# EAGLE design StinsonFuelGauge (EAGLE 4.16)
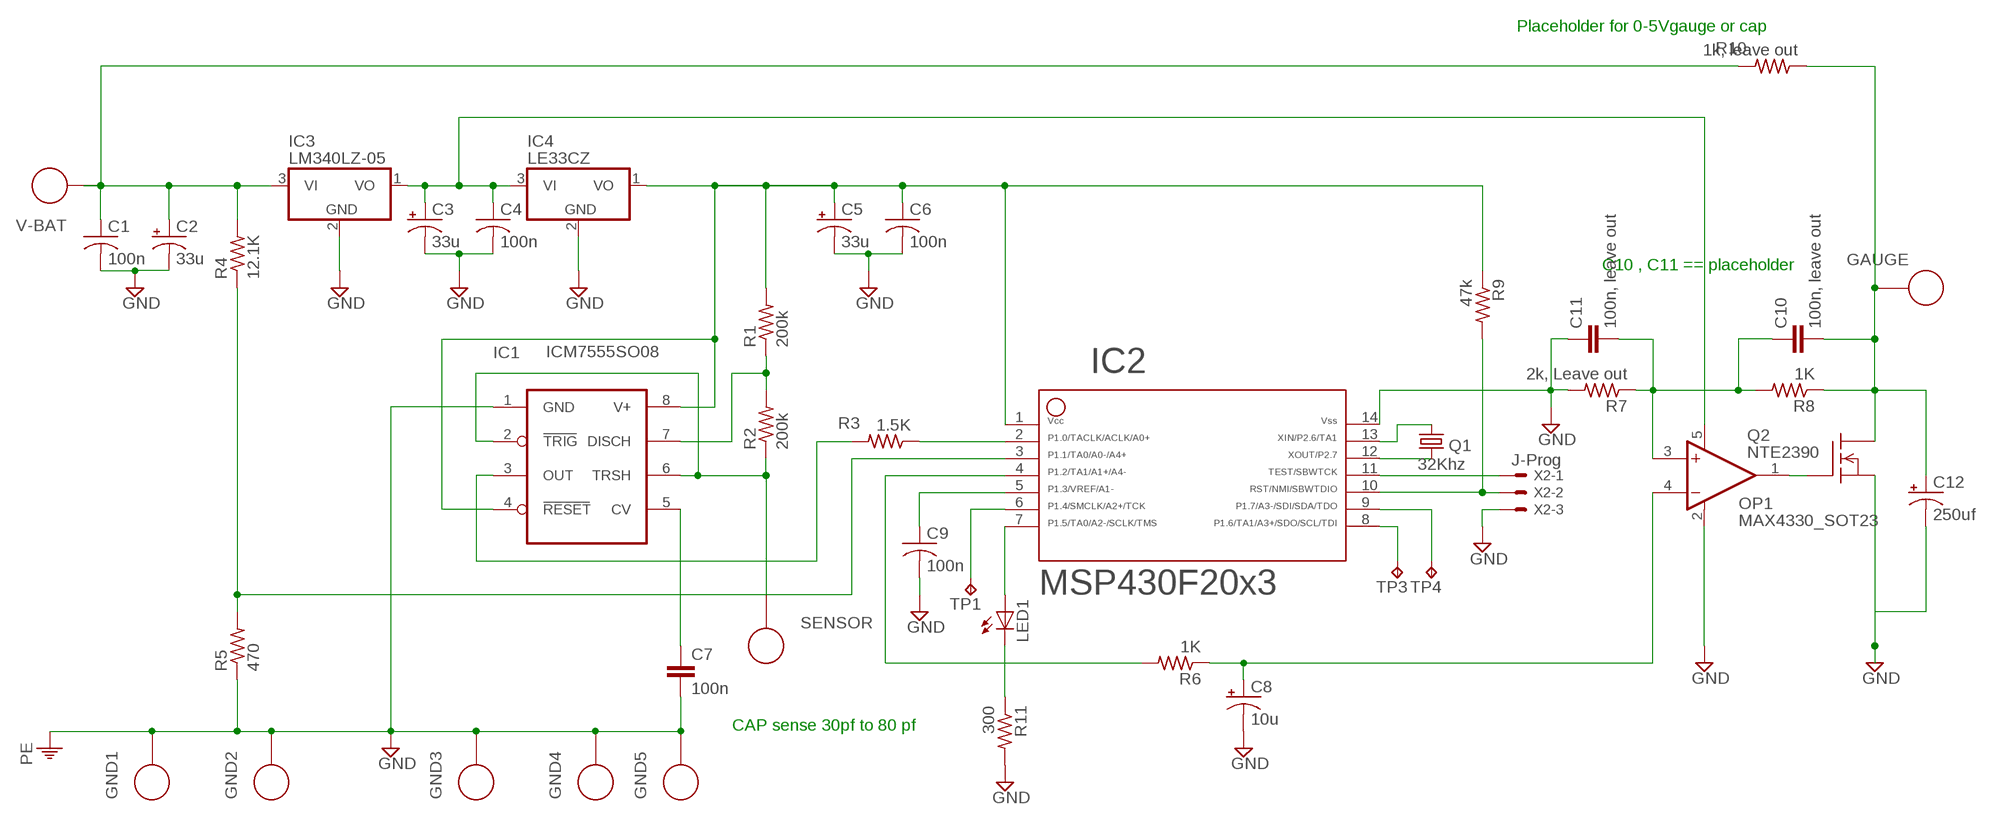
[diagram p0: schematic, sheet 1]

## Parts
C1  100n  C-USC0805  [C0805]
C2  33u  CPOL-USSMCD  [SMC_D]
C3  33u  CPOL-USSMCD  [SMC_D]
C4  100n  C-USC0805  [C0805]
C5  33u  CPOL-USSMCD  [SMC_D]
C6  100n  C-USC0805  [C0805]
C7  100n  C-EUC0805  [C0805]
C8  10u  CPOL-USSMCE  [SMC_E]
C9  100n  C-USC0805  [C0805]
C10  100n, leave out  C-EUC0805  [C0805]
C11  100n, leave out  C-EUC0805  [C0805]
C12  250uf  CPOL-USSMCE  [SMC_E]
GAUGE  TP_1TPAD_300  [PAD_1]
GND1  GND_PADTP_400  [PAD_2]
GND2  GND_PADTP_400  [PAD_2]
GND3  GND_PADTP_400  [PAD_2]
GND4  GND_PADTP_400  [PAD_2]
GND5  GND_PADTP_400  [PAD_2]
IC1  ICM7555SO08  [SO08]
IC2  F20X3---PW14  [PW14]
IC3  LM340LZ-05  [TO92]
IC4  LE33CZ  [TO92-]
LED1  LEDCHIP-LED0603  [CHIP-LED0603]
OP1  MAX4330_SOT23  [SOT23-5L]
Q1  32Khz  CRYSTALTC26H  [TC26H]
Q2  NTE2390  [TO220]
R1  200k  R-US_R0805  [R0805]
R2  200k  R-US_R0805  [R0805]
R3  1.5K  R-US_R0805  [R0805]
R4  12.1K  R-US_R0805  [R0805]
R5  470  R-US_R0805  [R0805]
R6  1K  R-US_R0805  [R0805]
R7  2k, Leave out  R-US_R0805  [R0805]
R8  1K  R-US_R0805  [R0805]
R9  47k  R-US_R0805  [R0805]
R10  1k, leave out  R-US_R0805  [R0805]
R11  300  R-US_R0805  [R0805]
SENSOR  TP_1TPAD_300  [PAD_1]
TP1  TPPAD1-13  [P1-13]
TP3  TPPAD1-13  [P1-13]
TP4  TPPAD1-13  [P1-13]
V-BAT  TP_1TPAD_300  [PAD_1]
X2  J-Prog  22-23-2031  [22-23-2031]

## Nets
C_SEN: IC1.2(TRIG) IC1.6(TRSH) R2.1 SENSOR.P$1
GND: C1.2 C2.- C3.- C4.2 C5.- C6.2 C7.2 C8.- C9.2 C11.1 C12.- GND1.P$1 GND2.P$1 GND3.P$1 GND4.P$1 GND5.P$1 IC1.1(GND) IC2.14 IC3.2(GND) IC4.2(GND) OP1.2(V-) Q2.3(S) R5.1 R7.2 R11.2 X2.3 ; supply symbol labelled PE
N$1: IC2.6 TP1.1(TP)
N$2: IC2.12 Q1.2
N$3: IC2.13 Q1.1
N$4: IC2.7 LED1.A
N$5: OP1.1(OUT) Q2.1(G)
N$7: IC1.7(DISCH) R1.1 R2.2
N$8: IC2.8 TP3.1(TP)
N$9: IC1.3(OUT) R3.2
N$10: C7.1 IC1.5(CV)
N$11: IC2.2 R3.1
N$12: IC2.9 TP4.1(TP)
N$13: IC2.3 R4.1 R5.2
N$14: C9.1 IC2.5
N$15: C8.+ OP1.4(-IN) R6.1
N$16: IC2.11 X2.1
N$17: C10.1 C11.2 OP1.3(+IN) R7.1 R8.2
N$18: C10.2 C12.+ GAUGE.P$1 Q2.2(D) R8.1 R10.1
N$19: LED1.C R11.1
N$20: IC2.10 R9.2 X2.2
PW_OUT: IC2.4 R6.2
V3_3V: C5.+ C6.1 IC1.4(RESET) IC1.8(V+) IC2.1 IC4.1(VO) R1.2 R9.1
V-5V: C3.+ C4.1 IC3.1(VO) IC4.3(VI) OP1.5(V+)
V-BAT: C1.1 C2.+ IC3.3(VI) R4.2 R10.2 V-BAT.P$1

## Notes on the sheet
- Placeholder for 0-5Vgauge or cap
- C10 , C11 == placeholder
- CAP sense 30pf to 80 pf

## Library data of the parts
C1 C4 C6 C9 = rcl:C-US: CAPACITOR, American symbol
C2 C3 C5 C8 C12 = rcl:CPOL-US: POLARIZED CAPACITOR, American symbol
C7 C10 C11 = rcl:C-EU: CAPACITOR, European symbol
GAUGE SENSOR V-BAT = ZStofer:TP_1
GND1-GND5 = ZStofer:GND_PAD
IC1 = Stofer:ICM7555: TIMER
IC2 = TI_MSP430_v12:F20X3---PW14: ***MSP430F20x3***PW14
IC3 = ZStofer:LM340?-*: Positive VOLTAGE REGULATOR Source: http://cache.national.com/ds/LM/LM340.pdf
IC4 = ZStofer:LE33CZ
LED1 = led:LED: LED OSRAM: - CHIPLED LG R971, LG N971, LY N971, LG Q971, LY Q971, LO R971, LY R971 LH N974, LH R974 LS Q976, LO Q976, LY Q976 LO Q996 - Hyper CHIPLED LW Q18S LB Q993, LB Q99A, LB R99A - SideLED LS A670, LO A670, LY A670, LG A670, LP A670 LB A673, LV A673, LT A673, LW A673 LH A674 LY A675 LS A676, LA A676, LO A676, LY A676, LW A676 LS A679, LY A679, LG A679 - Hyper Micro SIDELED® LS Y876, LA Y876, LO Y876, LY Y876 LT Y87S - SmartLED LW L88C, LW L88S LB L89C, LB L89S, LG L890 LS L89K, LO L89K, LY L89K LS L896, LA L896, LO L896, LY L896 - TOPLED LS T670, LO T670, LY T670, LG T670, LP T670 LSG T670, LSP T670, LSY T670, LOP T670, LYG T670 LG T671, LOG T671, LSG T671 LB T673, LV T673, LT T673, LW T673 LH T674 LS T676, LA T676, LO T676, LY T676, LB T676, LH T676, LSB T676, LW T676 LB T67C, LV T67C, LT T67C, LS T67K, LO T67K, LY T67K, LW E67C LS E67B, LA E67B, LO E67B, LY E67B, LB E67C, LV E67C, LT E67C LW T67C LS T679, LY T679, LG T679 LS T770, LO T770, LY T770, LG T770, LP T770 LB T773, LV T773, LT T773, LW T773 LH T774 LS E675, LA E675, LY E675, LS T675 LS T776, LA T776, LO T776, LY T776, LB T776 LHGB T686 LT T68C, LB T68C - Hyper Mini TOPLED® LB M676 - Mini TOPLED Santana® LG M470 LS M47K, LO M47K, LY M47K Source: http://www.osram.convergy.de - LUMILED® LXK2-PW12-R00, LXK2-PW12-S00, LXK2-PW14-U00, LXK2-PW14-V00 LXK2-PM12-R00, LXK2-PM12-S00, LXK2-PM14-U00 LXK2-PE12-Q00, LXK2-PE12-R00, LXK2-PE12-S00, LXK2-PE14-T00, LXK2-PE14-U00 LXK2-PB12-K00, LXK2-PB12-L00, LXK2-PB12-M00, LXK2-PB14-N00, LXK2-PB14-P00, LXK2-PB14-Q00 LXK2-PR12-L00, LXK2-PR12-M00, LXK2-PR14-Q00, LXK2-PR14-R00 LXK2-PD12-Q00, LXK2-PD12-R00, LXK2-PD12-S00 LXK2-PH12-R00, LXK2-PH12-S00 LXK2-PL12-P00, LXK2-PL12-Q00, LXK2-PL12-R00 Source: www.luxeon.com
OP1 = maxim-9:MAX4330
Q1 = crystal:CRYSTAL: CRYSTAL
Q2 = transistor-fet:NTE2390: N-Channel Enhancement MOSFET 60V; 12A
R1-R11 = rcl:R-US_: RESISTOR, American symbol
TP1 TP3 TP4 = ZStofer:TP
X2 = con-molex:22-23-2031: .100" (2.54mm) Center Header - 3 Pin

## Board
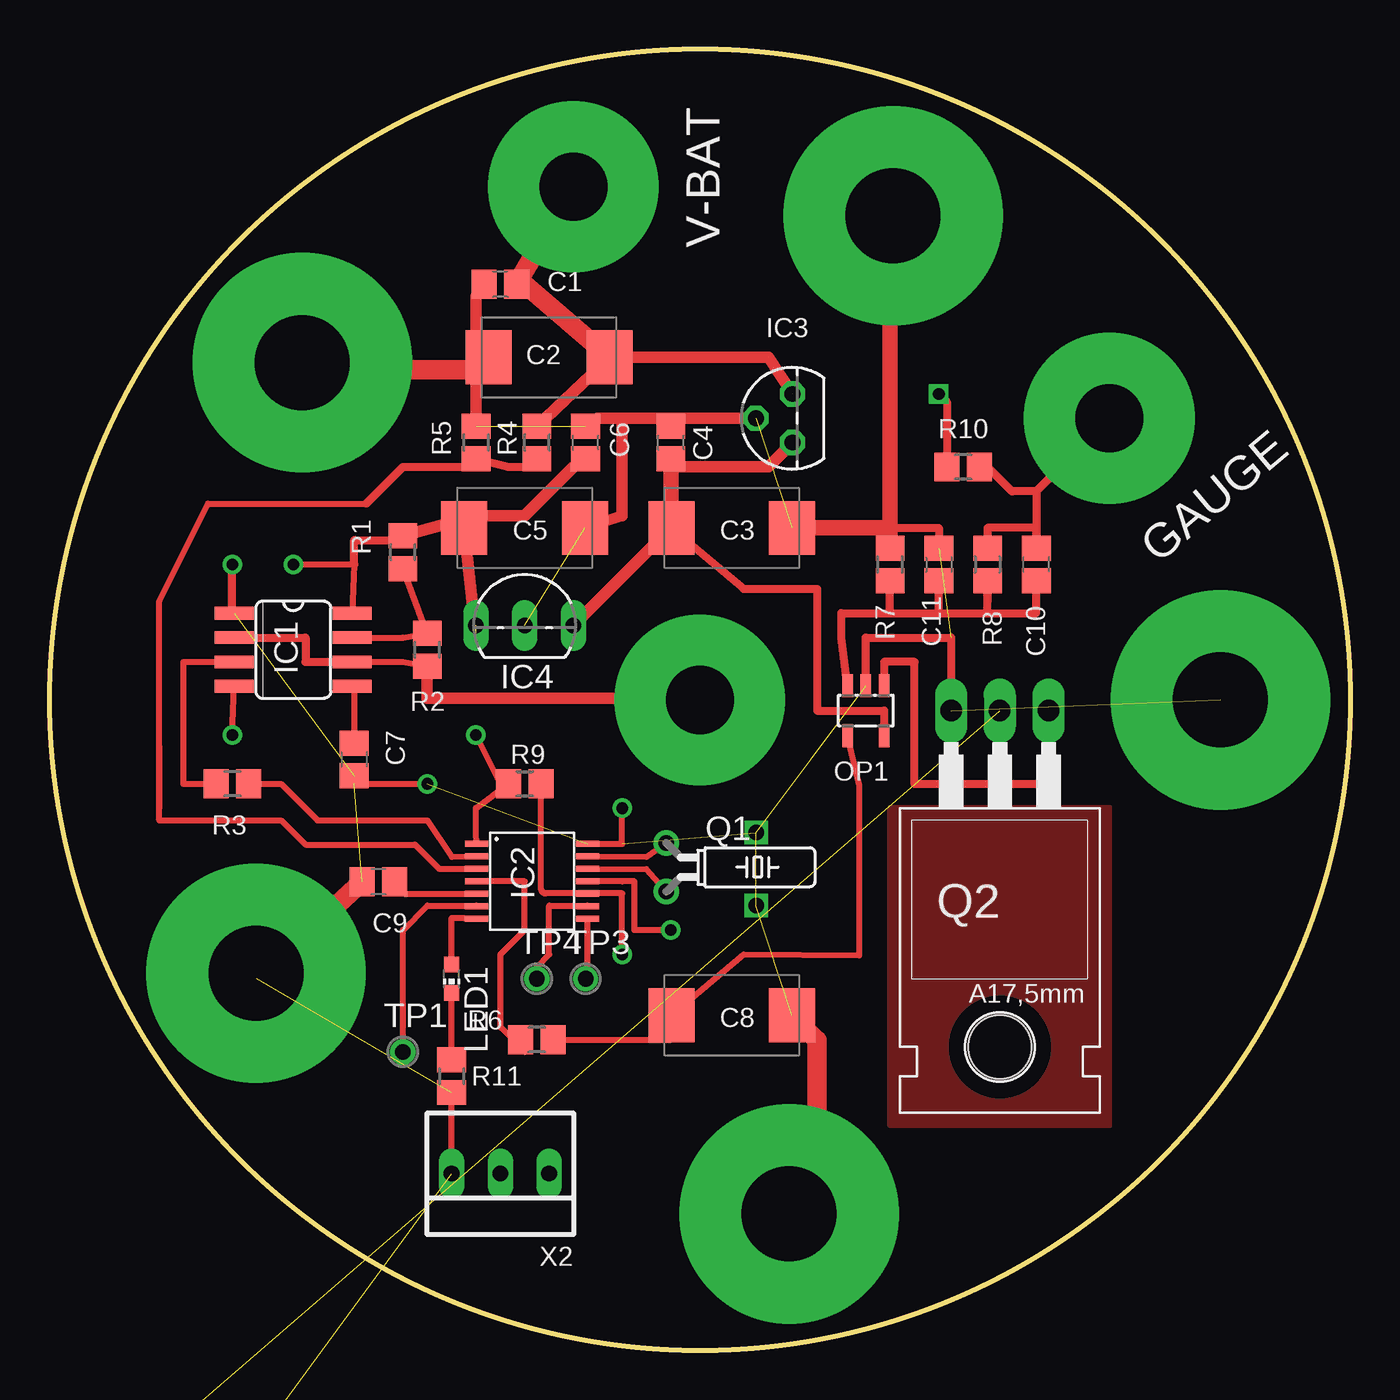
[diagram p1: board, top side]
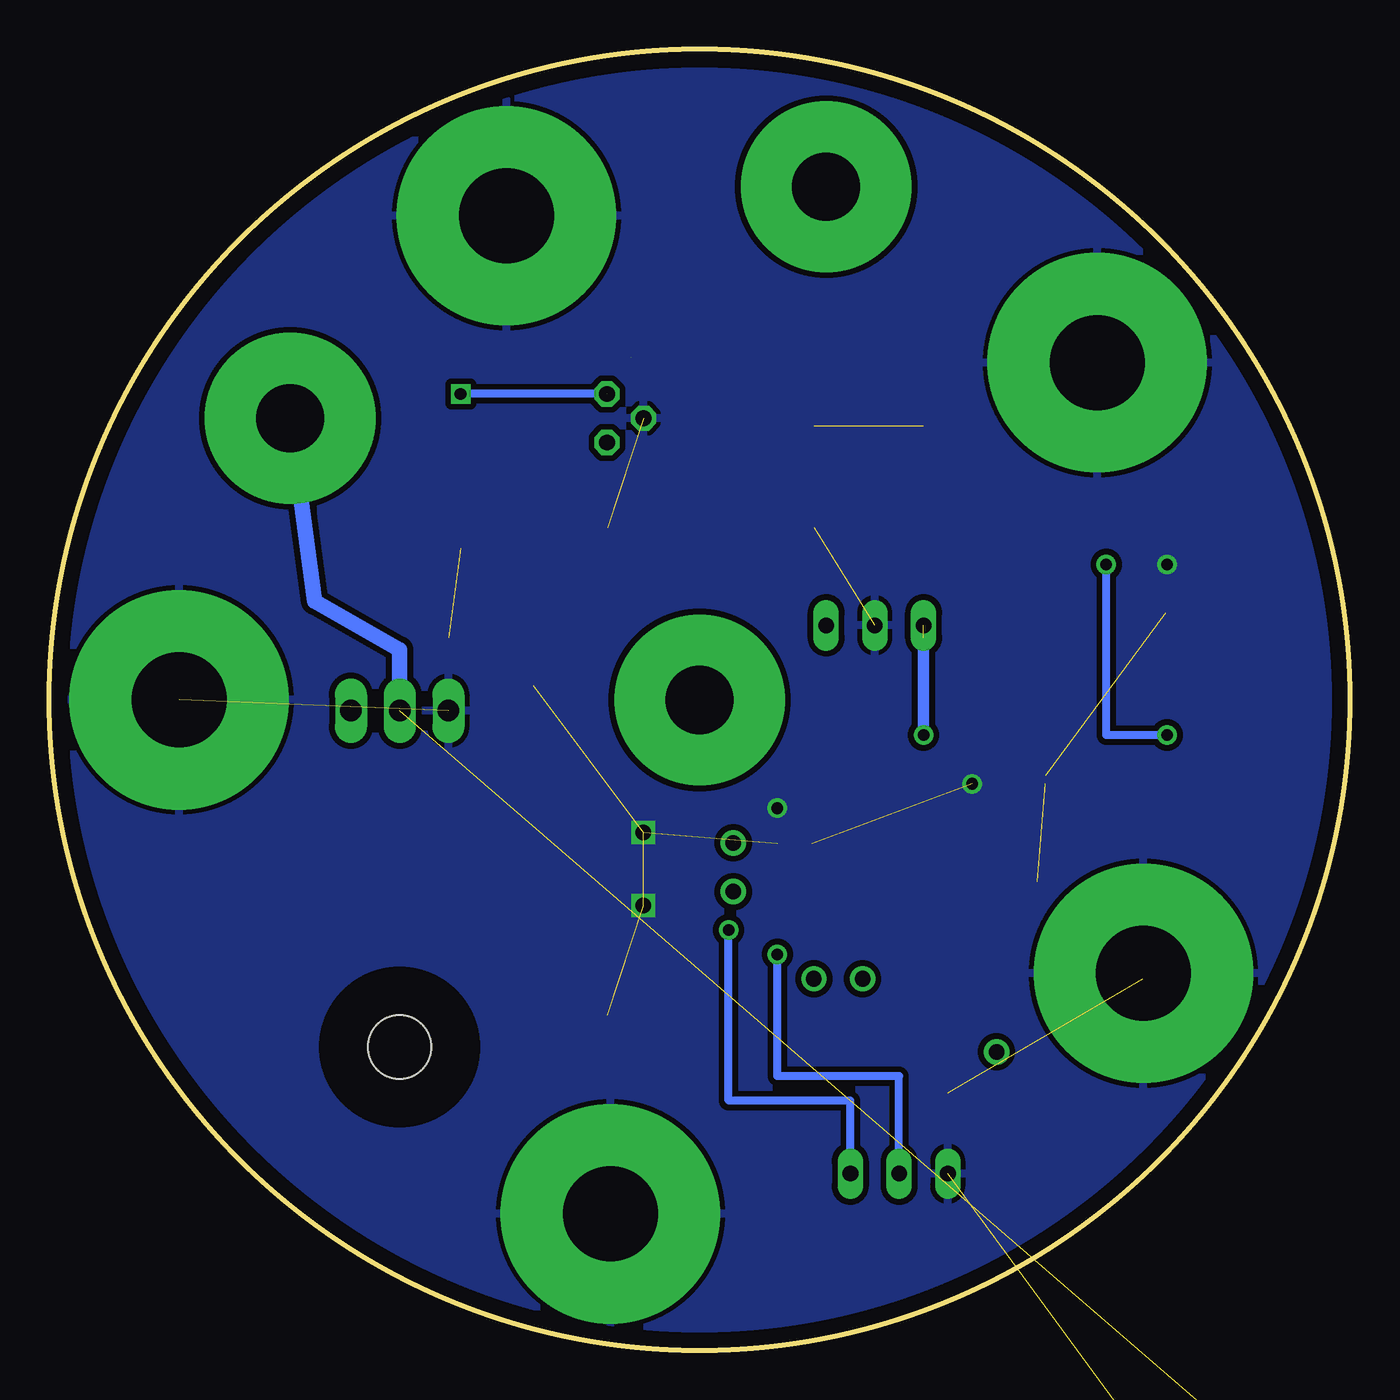
[diagram p2: board, bottom side, seen from below]

Size 67.96 x 67.96 mm. Coordinates in mm from the lower left corner, seen from the top.
Outline: circle at 33.98,33.98 radius 33.98
Copper layers (1*16): Top 0.035mm / dielectric 1.5mm / Bottom 0.035mm
Design rules "custompcb": minimum track width 10mil, minimum drill 24mil, track to track 12mil, track to pad 12mil, pad to pad 12mil, via to via 12mil, smd to smd 12mil, copper to edge 40mil, drill to drill 12mil, minimum pad ring 10mil, minimum via ring 8mil, stop-mask expansion 0mil, vias tented up to drill 0mil, thermal gap 10mil
Milling: area 0.1,0.1 to 67.9,67.9

### Footprints (pad centres in the part's own frame; a part is rotated, then mirrored left to right if it is on the bottom)
C0805 = smd 1.3 x 1.5: 1 -0.85,0; 2 0.85,0
SMC_D = smd 2.4 x 2.8: + -3.15,0; - 3.15,0
SMC_E = smd 2.4 x 2.8: + -3.15,0; - 3.15,0
PAD_1 = drill 3.556 pad 8.89 round: P$1 0,0
PAD_2 = drill 4.953 pad 11.43 round: P$1 0,0
SO08 = smd 0.66 x 2.032: 1 -1.905,-3.073; 2 -0.635,-3.073; 3 0.635,-3.073; 4 1.905,-3.073; 5 1.905,3.073; 6 0.635,3.073; 7 -0.635,3.073; 8 -1.905,3.073
PW14 = smd 0.3 x 1.2: 1 -2.98,-2.99; 2 -2.33,-2.99; 3 -1.68,-2.99; 4 -1.03,-2.99; 5 -0.38,-2.99; 6 0.27,-2.99; 7 0.92,-2.99; 8 0.92,2.81; 9 0.27,2.81; 10 -0.38,2.81; 11 -1.03,2.81; 12 -1.68,2.81; 13 -2.33,2.81; 14 -2.98,2.81
TO92 = drill 0.813 octagon: 1 -1.27,0; 2 0,1.905; 3 1.27,0
TO92- = drill 0.813 long: 1 -2.54,-1.27; 2 0,-1.27; 3 2.54,-1.27
CHIP-LED0603 = smd 0.8 x 0.8: A 0,-0.75; C 0,0.75
SOT23-5L = smd 0.55 x 1.2: 1 -0.95,-1.3; 2 0,-1.3; 3 0.95,-1.3; 4 0.95,1.3; 5 -0.95,1.3
TC26H = drill 0.813 round: 1 -1.27,0; 2 1.27,0
TO220 = drill 1.118 long: 1 -2.54,-6.35; 2 0,-6.35; 3 2.54,-6.35 | hole 3.302: 0,11.176
R0805 = smd 1.3 x 1.5: 1 -0.85,0; 2 0.85,0
P1-13 = drill 0.813 round: 1 0,0
22-23-2031 = drill 0.813 long: 1 -2.54,0; 2 0,0; 3 2.54,0

### Placement (x,y rotation side)
C1  23.59,55.65 180 top
C2  26.12,51.84 180 top
C3  35.65,42.95 0 top
C4  32.47,47.39 90 top
C5  24.85,42.95 0 top
C6  28.03,47.39 90 top
C7  15.96,30.88 270 top
C8  35.65,17.55 0 top
C9  17.23,24.51 180 top
C10  51.52,41.04 90 top
C11  46.44,41.04 270 top
C12  5.8,-7.22 0 top  (outside the outline)
GAUGE  55.33,48.66 0 top
GND1  44.06,59.21 0 top
GND2  10.85,19.74 0 top
GND3  61.13,33.98 0 top
GND4  38.64,7.2 0 top
GND5  13.26,51.56 90 top
IC1  12.79,36.6 270 top
IC2  25.33,23.5 270 top
IC3  38.81,48.66 90 top
IC4  24.85,39.14 0 top
LED1  21.04,19.45 180 top
OP1  42.63,33.42 180 top
Q1  32.23,25.27 270 top
Q2  49.63,27.07 180 top
R1  18.5,41.68 90 top
R2  19.77,36.6 90 top
R3  9.61,29.61 180 top
R4  25.49,47.39 90 top
R5  22.31,47.39 270 top
R6  25.49,16.28 180 top
R7  43.9,41.04 90 top
R8  48.98,41.04 270 top
R9  24.85,29.61 0 top
R10  47.71,46.12 180 top
R11  21.04,14.37 270 top
SENSOR  33.99,33.98 0 top
TP1  18.5,15.64 0 top
TP3  28.03,19.45 0 top
TP4  25.49,19.45 0 top
V-BAT  27.39,60.73 90 top
X2  23.58,9.29 180 top

### Tracks (layer width: path | path; a pad name or v marks a point on that pad's centre or on a via)
C_SEN
  Top 0.305: R2.1 18.5,35.96 15.96,35.96 | 34.38,34.06 SENSOR.P$1
  Top 0.406: IC1.2 13.42,37.23 13.42,35.96 IC1.6 15.96,35.96
  Top 0.61: R2.1 19.77,34.06 34.38,34.06
GND  (via drill 0.61, 0.81)  (14 unrouted)
  Top 0.305: C7.2 15.96,29.61 v19.77,29.61 | Q2.3 | IC2.14 29.93,26.48 v29.93,28.34 | X2.3 R11.2
  Top 0.406: IC1.1 9.61,38.5 v9.61,41.04 | GND2.P$1 10.88,19.45 | OP1.2 42.63,37.23 47.08,37.23 Q2.3 | 22.31,51.2 C2.- 22.31,51.84 | 22.31,55.01 C1.2 | GND5.P$1 13.42,51.2 | 32.47,48.66 C4.2 | 28.66,48.66 C6.2 | GND4.P$1 38.82,6.75 40.09,8.02 | C11.1 46.44,42.95 43.9,42.95
  Top 0.61: 22.31,51.2 R5.1 | 22.31,51.84 22.31,55.01 | 29.93,48.66 28.66,48.66 | 29.93,48.66 32.47,48.66 35.65,48.66 | C5.- 29.93,43.58 29.93,48.66 | 35.65,48.66 | 35.65,48.66 IC3.2
  Top 0.813: 43.9,42.95 R7.2 | 43.9,42.95 43.9,58.82 | C3.- 43.9,42.95
  Top 1.016: 10.88,19.45 C9.2 | C8.- 40.09,16.25 40.09,8.02 | 13.42,51.2 22.31,51.2 | 43.9,58.82 GND1.P$1
  other vias: 36.92,27.07 36.92,23.26
  pour Bottom: 48.98,70.25 69.3,48.66 69.3,18.18 48.98,-2.14 22.31,-2.14 -1.82,15.64 -1.82,52.47 21.04,70.25
N$1
  Top 0.305: IC2.6 22.34,23.26 19.77,23.26 18.5,21.99 TP1.1
N$2
  Top 0.305: IC2.12 31.2,25.17 Q1.2
N$3
  Top 0.305: IC2.13 31.2,25.8 Q1.1
N$4
  Top 0.305: LED1.A 21.04,22.63 21.68,22.63 21.73,22.58 IC2.7
N$5
  Top 0.305: Q2.1
  Top 0.406: Q2.1 52.16,29.61 45.17,29.61 45.17,35.96 43.58,35.96 OP1.1
N$6
  pour Top: 43.9,28.34 43.9,11.83 55.33,11.83 55.33,28.34
N$7
  Top 0.305: IC1.7 18.5,37.23 R2.2 R1.1
N$8
  Top 0.305: IC2.8 28.14,19.45 TP3.1
N$9
  Top 0.305: IC1.3 7.07,35.96 7.07,29.61 R3.2
  Top 0.406: R3.2 8.69,29.56
N$10
  Top 0.305: 15.96,34.69 C7.1
  Top 0.406: IC1.5 15.96,34.69
N$11
  Top 0.305: IC2.2 21.04,25.8 19.77,27.71 14.06,27.71 12.15,29.61 R3.1
N$12
  Top 0.305: IC2.9 28.11,23.26 26.12,23.26 26.12,20.72 25.49,20.09 TP4.1
N$13
  Top 0.305: 16.6,44.22 8.34,44.22 5.8,39.14 5.8,31.55 | 5.8,31.55 5.8,28.34 | 5.8,31.55 5.8,27.71 12.15,27.71 13.42,26.44 19.14,26.44 20.4,25.18 IC2.3
  Top 0.406: 16.6,44.22 18.5,46.12 22.31,46.12 R5.2 24,46.12 25.07,46.12 R4.1
N$14
  Top 0.305: IC2.5 18.56,23.89 C9.1
N$15
  Top 0.305: R6.1 32.47,16.28 C8.+ 36.28,20.72 42.3,20.68 42.3,29.54 OP1.4
N$16  (via drill 0.61)
  Top 0.305: IC2.11 29.93,24.53 arc90 29.93,24.53 30.57,24.53 30.57,21.99 v32.47,21.99
  Bottom 0.406: v32.47,21.99 32.47,13.1 26.12,13.1 X2.1
N$17
  Top 0.406: 48.98,39.14 R8.2 48.98,38.5 | C10.1 51.52,39.14 51.52,38.5 48.98,38.5 | OP1.3 41.36,37.23 41.36,38.5 43.9,38.5 | 43.9,38.5 46.44,38.5 | 46.44,38.5 48.98,38.5 | 46.44,38.5 C11.2 | 43.9,38.5 R7.1
N$18  (1 unrouted)
  Top 0.406: R8.1 48.98,42.95 51.52,42.95 C10.2 | C10.2 51.52,41.68 | 51.52,44.85 C10.2 | GAUGE.P$1 51.52,44.85 | R10.1 48.98,46.12 50.25,44.85 51.52,44.85
  Bottom 0.813: Q2.2 49.62,36.6 54.06,39.14 GAUGE.P$1
N$19
  Top 0.305: R11.1 LED1.C
N$20  (via drill 0.61)
  Top 0.305: R9.2 25.7,24.15 arc90 25.96,23.9 28.03,23.9 | 28.03,23.9 28.12,23.9 arc-90 IC2.10 28.03,23.9 | v29.93,20.72 29.93,23.9 28.03,23.9
  Bottom 0.406: X2.2 23.58,14.37 29.93,14.37 v29.93,20.72
PW_OUT
  Top 0.305: R6.2 24.85,15.64 23.58,16.91 23.58,20.72 24.85,21.99 24.85,24.53 22.31,24.53 IC2.4
V3_3V  (via drill 0.61)  (1 unrouted)
  Top 0.305: v9.61,32.15 IC1.4 | v12.79,41.04 15.96,41.04 IC1.8 | 23.58,29.61 v22.31,32.15 | R9.1 22.31,28.34 22.31,27.07 IC2.1 | 22.31,43.58 C5.+
  Top 0.406: R9.1 23.58,29.61 | 15.96,41.04 15.96,42.31 18.5,42.31 R1.2 | 27.39,46.12 C6.1
  Top 0.61: R1.2 22.31,43.58 24.85,43.58 27.39,46.12 | C5.+ 22.31,37.23
  Bottom 0.406: v9.61,32.15 12.79,32.15 v12.79,41.04
  Bottom 0.61: v22.31,32.15 IC4.1
V-5V
  Top 0.406: OP1.5 43.58,33.42 40.09,33.42 40.09,39.77 36.28,39.77 32.47,42.95
  Top 0.61: IC4.3 32.47,42.95 | 32.47,46.39 32.74,46.12 37.55,46.12 IC3.1
  Top 0.813: 32.47,42.95 32.47,46.39 C4.1
  Top 1.016: 32.47,42.95 C3.+
V-BAT  (via drill 0.61)  (2 unrouted)
  Top 0.406: 29.3,51.84 C2.+ | 24.85,55.65 C1.1 | R10.2 46.86,49.51 v46.44,49.93
  Top 0.61: R4.2 29.3,51.84 | IC3.3 37.55,51.84 | C2.+ 37.55,51.84
  Top 1.016: C2.+ 24.85,55.65 | C1.1 V-BAT.P$1
  Bottom 0.406: IC3.3 | IC3.3 v46.44,49.93

### Text on the board
tPlace: V-BAT | GAUGE
Drill_legend: Drill legend | Date: 6/22/2007 09:53:17a | 4.9530 mm / 195.000 mil | 3.5560 mm / 140.000 mil | 3.3020 mm / 130.000 mil | 1.1176 mm / 44.000 mil | 0.8128 mm / 32.000 mil | 0.6096 mm / 24.000 mil